# Altium schematic sheet Var4.SchDoc
size A4; SheetNumber: 7; SheetTotal: 12
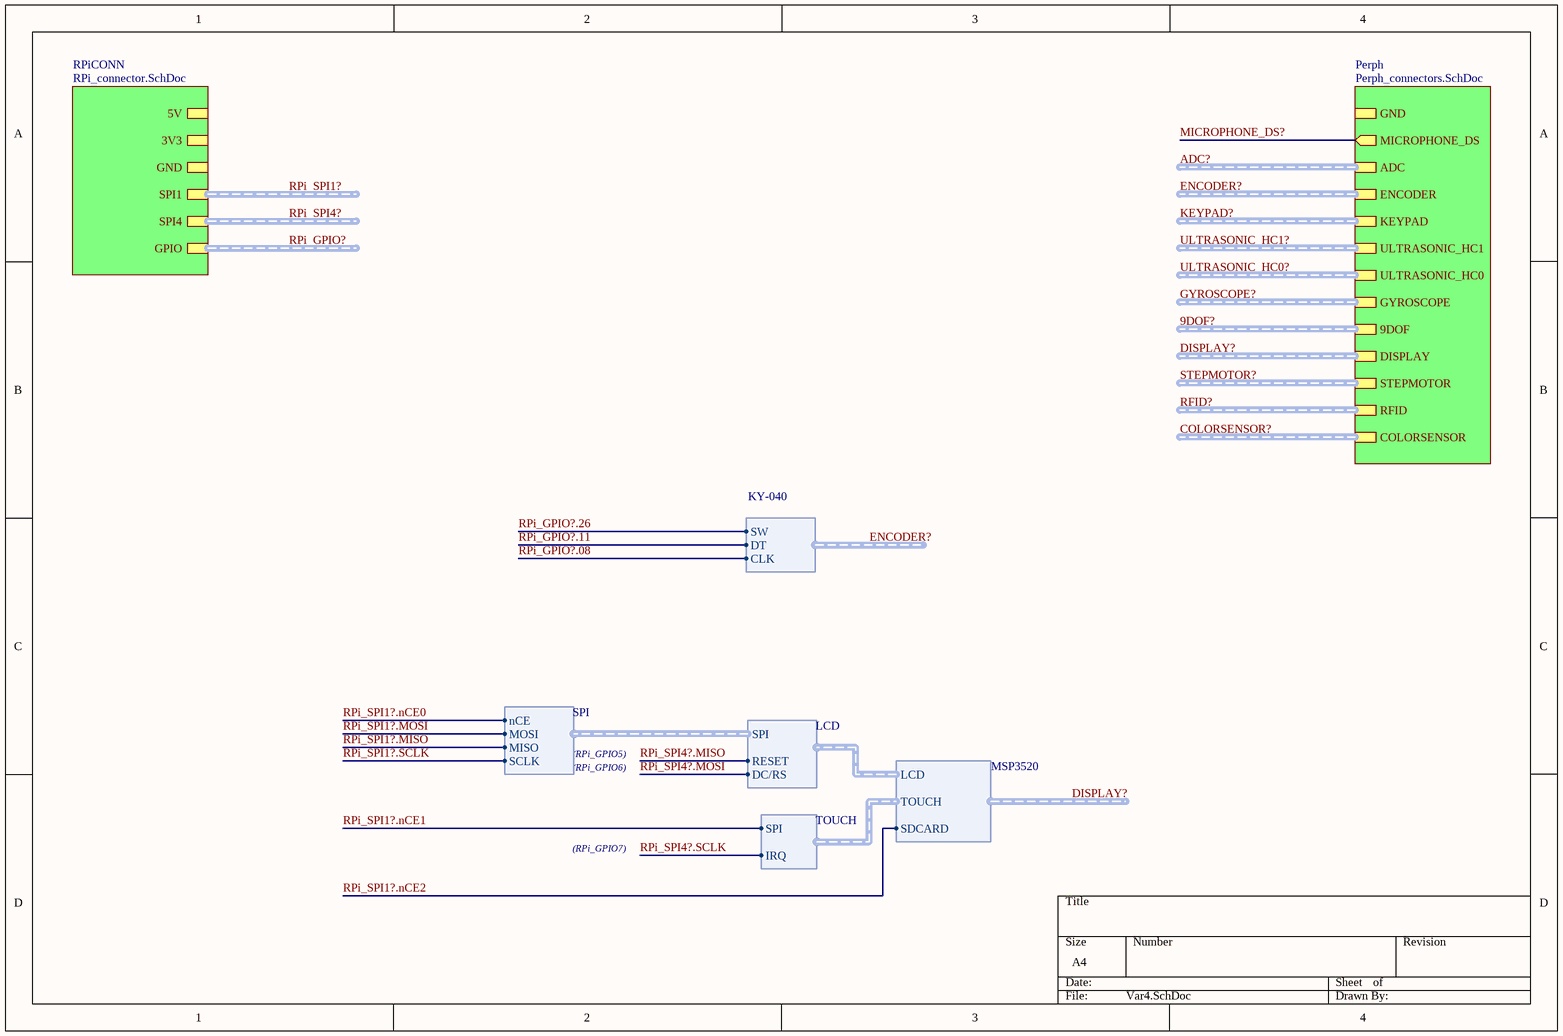
[diagram p0: Var4.SchDoc]

## Sub-sheets
Perph = Perph_connectors.SchDoc: MICROPHONE_DS (out), ADC (harness ADS1115 module), GYROSCOPE (harness GY-50 L3GD20 Gyro), ULTRASONIC_HC1 (harness HC-SR04), GND, KEYPAD (harness Keypad COM-08653), ULTRASONIC_HC0 (harness HC-SR04), DISPLAY (harness MSP3520), STEPMOTOR (harness ULN2003 Module), RFID (harness RC522), ENCODER (harness KY-040), COLORSENSOR (harness TCS34725), 9DOF (harness 9DOF)
RPiCONN = RPi_connector.SchDoc: 5V, 3V3, GND, SPI4 (harness SPI_2CS), SPI1 (harness SPI_3CS), GPIO (harness RPI_GPIO)

## Harnesses
SPI: nCE, MISO, MOSI, SCLK
LCD: SPI, RESET, DC/RS
TOUCH: SPI, IRQ
MSP3520: LCD, TOUCH, SDCARD
KY-040: CLK, SW, DT

## Nets
MICROPHONE_DS?: sheet Perph/MICROPHONE_DS
RPi_GPIO?.08: sheet Perph/ENCODER.CLK  [project net ENCODER?.CLK]
RPi_GPIO?.11: sheet Perph/ENCODER.DT  [project net ENCODER?.DT]
RPi_GPIO?.26: sheet Perph/ENCODER.SW  [project net ENCODER?.SW]
RPi_SPI1?.MISO: harness SPI.MISO
RPi_SPI1?.MOSI: harness SPI.MOSI
RPi_SPI1?.nCE0: harness SPI.nCE
RPi_SPI1?.SCLK: harness SPI.SCLK
RPi_SPI4?.MISO: harness LCD.RESET
RPi_SPI4?.MOSI: harness LCD.DC/RS
RPi_SPI4?.SCLK: harness TOUCH.IRQ

## Buses and harness runs
harness 9DOF? = sheet Perph/9DOF
harness ADC? = sheet Perph/ADC
harness COLORSENSOR? = sheet Perph/COLORSENSOR
harness DISPLAY? = sheet Perph/DISPLAY
harness ENCODER? = sheet Perph/ENCODER
harness GYROSCOPE? = sheet Perph/GYROSCOPE
harness KEYPAD? = sheet Perph/KEYPAD
harness RFID? = sheet Perph/RFID
harness RPi_GPIO? = sheet RPiCONN/GPIO
harness RPi_SPI1? = sheet RPiCONN/SPI1
harness RPi_SPI4? = sheet RPiCONN/SPI4
harness STEPMOTOR? = sheet Perph/STEPMOTOR
harness ULTRASONIC_HC0? = sheet Perph/ULTRASONIC_HC0
harness ULTRASONIC_HC1? = sheet Perph/ULTRASONIC_HC1

## Notes on the sheet
- (RPi_GPIO5)
- (RPi_GPIO6)
- (RPi_GPIO7)